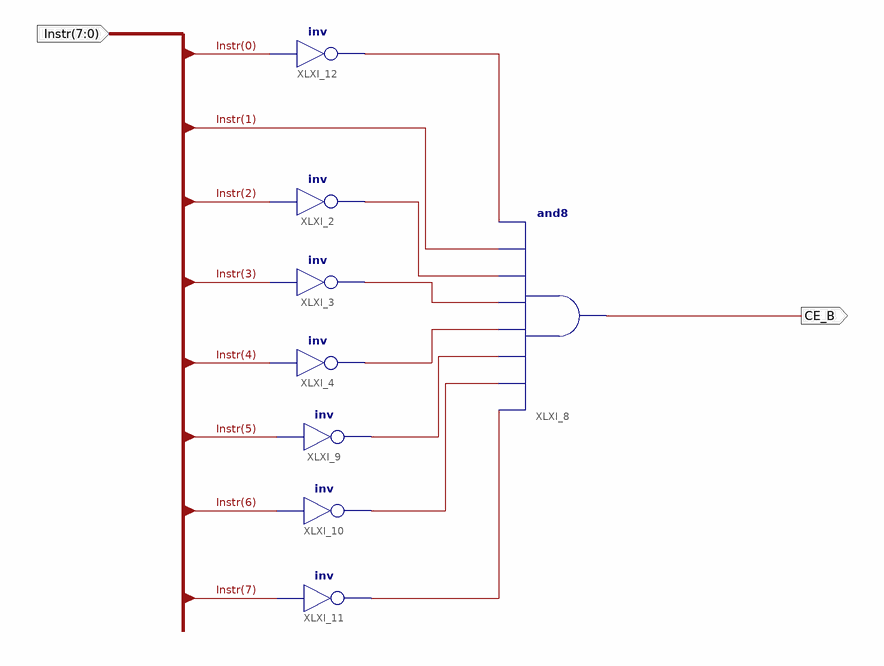
[diagram p0: schematic sheet 1]
// Xilinx ISE schematic instrLDB.sch (spartan3e) as structural Verilog: 8 symbols, 2 ports
module instrLDB (
  input  [7:0] Instr,
  output CE_B
);

  wire XLXN_3, XLXN_4, XLXN_5, XLXN_6, XLXN_7, XLXN_10, XLXN_12;

  not XLXI_2 (XLXN_3, Instr[2]);
  not XLXI_3 (XLXN_4, Instr[3]);
  not XLXI_4 (XLXN_5, Instr[4]);
  not XLXI_9 (XLXN_6, Instr[5]);
  not XLXI_10 (XLXN_7, Instr[6]);
  not XLXI_11 (XLXN_10, Instr[7]);
  and XLXI_8 (CE_B, XLXN_10, XLXN_7, XLXN_6, XLXN_5, XLXN_4, XLXN_3, Instr[1], XLXN_12);
  not XLXI_12 (XLXN_12, Instr[0]);
endmodule
